# EasyEDA Pro project ProProject_EL_Driver_2024-06-29.epro

# Schematic Schematic1_1

## Sheets
1 MAIN: Create Date: 2024-05-11; Page Name: MAIN; Project Name: EL_Driver; Schematic Name: Schematic1_1; Update Date: 2024-05-11; Company: 嘉立创EDA; Page Size: A4; Version: V1.0
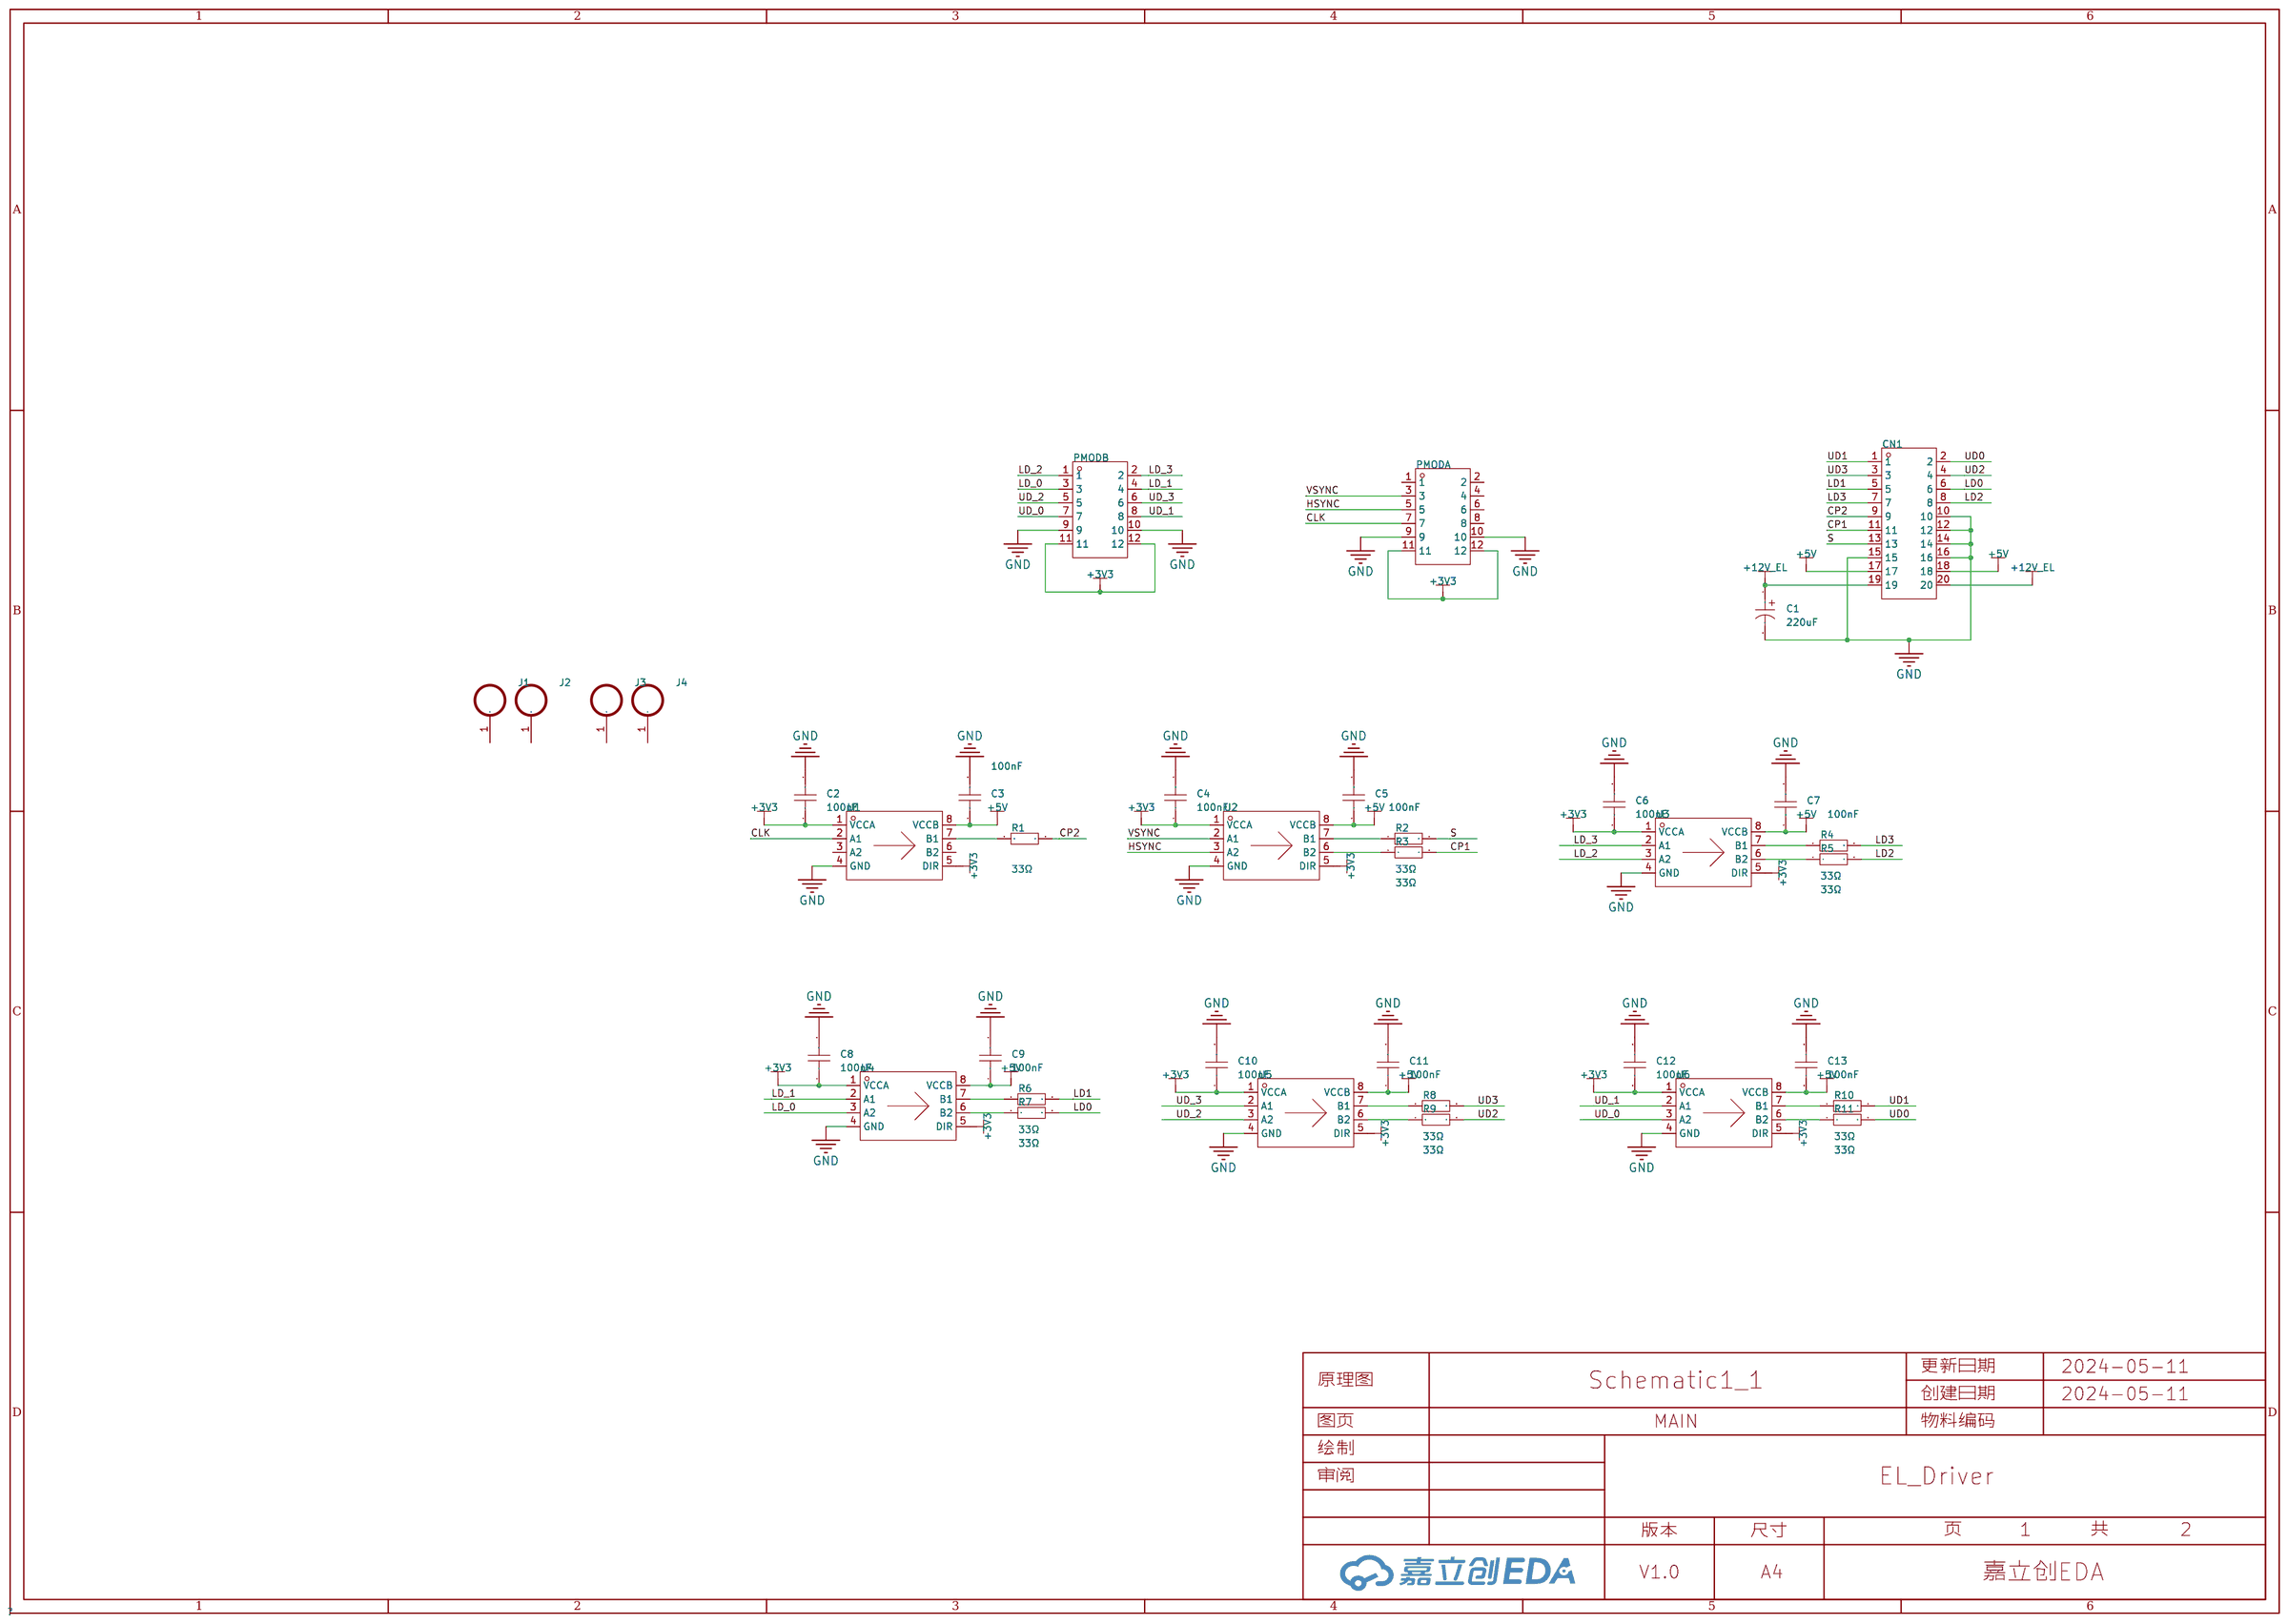
[diagram p0: MAIN]
2 POWER: Page Name: POWER
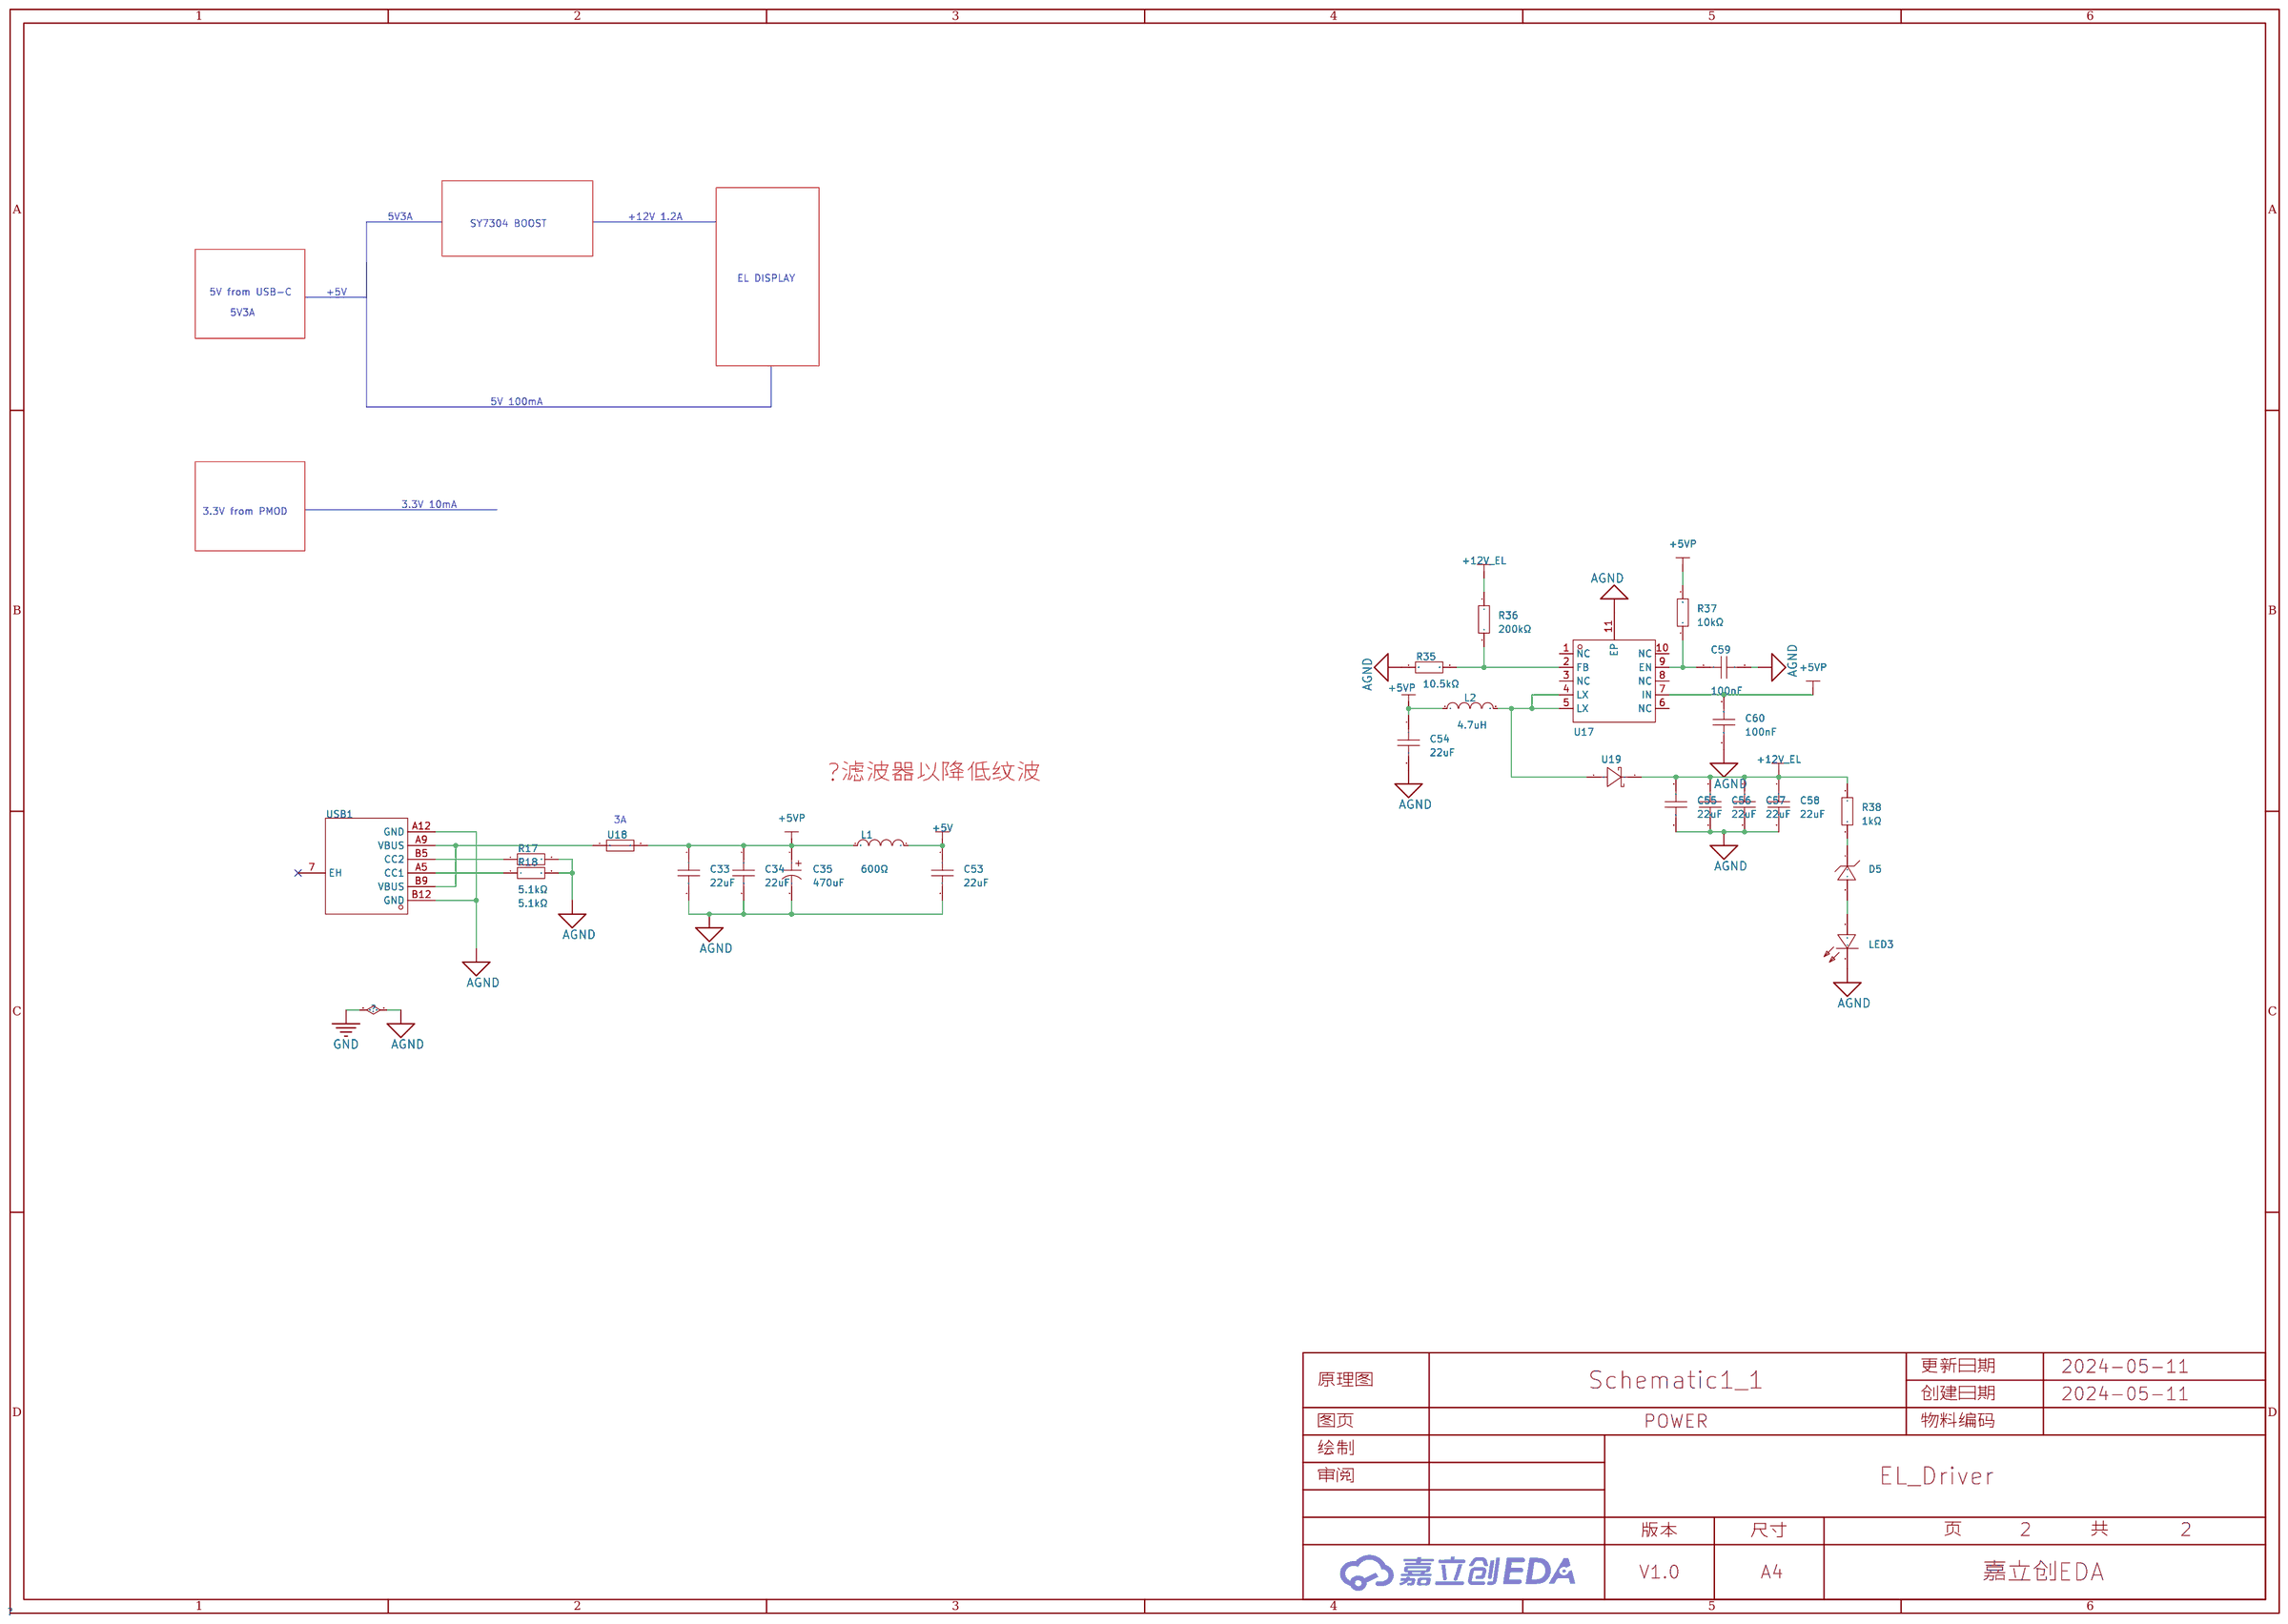
[diagram p1: POWER]

## Parts
sheet MAIN
C1  220uF  [CAP-SMD_BD6.3-L6.6-W6.6-FD]
C2  100nF  [C0603]
C3  100nF  [C0603]
C4  100nF  [C0603]
C5  100nF  [C0603]
C6  100nF  [C0603]
C7  100nF  [C0603]
C8  100nF  [C0603]
C9  100nF  [C0603]
C10  100nF  [C0603]
C11  100nF  [C0603]
C12  100nF  [C0603]
C13  100nF  [C0603]
CN1  HC-PHD-2*10AW  [CONN-TH_20P-P2.00_HCTL_HC-PHD]
J1  -  [螺孔]
J2  -  [螺孔]
J3  -  [螺孔]
J4  -  [螺孔]
PMODA  CS-1107-2X6(L14/19)  [HDR-TH_12P-P2.54-H-M-R2-C6-S2.54-W9.5-N]
PMODB  CS-1107-2X6(L14/19)  [HDR-TH_12P-P2.54-H-M-R2-C6-S2.54-W9.5-N]
R1  33Ω  [R0603]
R2  33Ω  [R0603]
R3  33Ω  [R0603]
R4  33Ω  [R0603]
R5  33Ω  [R0603]
R6  33Ω  [R0603]
R7  33Ω  [R0603]
R8  33Ω  [R0603]
R9  33Ω  [R0603]
R10  33Ω  [R0603]
R11  33Ω  [R0603]
U1  SN74LVC2T45DCUT  [VSSOP-8_L2.3-W2.0-P0.50-LS3.1-BL]
U2  SN74LVC2T45DCUT  [VSSOP-8_L2.3-W2.0-P0.50-LS3.1-BL]
U3  SN74LVC2T45DCUT  [VSSOP-8_L2.3-W2.0-P0.50-LS3.1-BL]
U4  SN74LVC2T45DCUT  [VSSOP-8_L2.3-W2.0-P0.50-LS3.1-BL]
U5  SN74LVC2T45DCUT  [VSSOP-8_L2.3-W2.0-P0.50-LS3.1-BL]
U6  SN74LVC2T45DCUT  [VSSOP-8_L2.3-W2.0-P0.50-LS3.1-BL]
sheet POWER
C33  22uF  [C0805]
C34  22uF  [C0805]
C35  470uF  [CAP-SMD_BD6.3-L6.6-W6.6-LS7.6-RD]
C53  22uF  [C0805]
C54  22uF  [C0805]
C55  22uF  [C0805]
C56  22uF  [C0805]
C57  22uF  [C0805]
C58  22uF  [C0805]
C59  100nF  [C0603]
C60  100nF  [C0603]
D5  LMSZ5239BT1G  [SOD-123_L2.7-W1.6-LS3.7-RD]
L1  600Ω  [L0603]
L2  4.7uH  [IND-SMD_L5.4-W5.2_FXL0530]
LED3  KT-0603R  [LED0603-RD]
R17  5.1kΩ  [R0603]
R18  5.1kΩ  [R0603]
R35  10.5kΩ  [R0603]
R36  200kΩ  [R0603]
R37  10kΩ  [R0603]
R38  1kΩ  [R0603]
U17  SY7304DBC  [DFN-10_L3.0-W3.0-P0.50-BL-EP]
U18  1812L300/12GR  [F1812]
U19  SS54  [SMB_L4.3-W3.6-LS5.4-RD]
USB1  TYPE-C 6P(073)  [TYPE-C-SMD_TYPE-C-6P]

## Library data of the parts
C1 = RVT220UF16V67RV0015: 容值:220uF;精度:±20%;额定电压:16V;纹波电流:110mA@120Hz;等效串联电阻:-;; LCSC Part Name: 220uF ±20% 16V; Supplier Part: C2887273; Manufacturer: KNSCHA(科尼盛); Supplier Footprint: SMD,D6.3xL7.7mm; JLCPCB Part Class: 扩展库; Datasheet: https://atta.szlcsc.com/upload/public/pdf/source/20210824/3DC9999D9B098FE241E3A26137981C4C.pdf; Supplier: LCSC; Tolerance: ±20%; Rated Voltage: 16V; Ripple Current: 110mA@120Hz; φD: 6.3mm; L: 7.7mm; Lifetime @ Temp: 2000hrs@105℃; Operating Temperature: -55℃~+105℃
C2-C13 C59 C60 = CC0603KRX7R9BB104: 容值:100nF;精度:±10%;额定电压:50V;材质(温度系数):X7R;; LCSC Part Name: 100nF ±10% 50V; Supplier Part: C14663; Manufacturer: YAGEO(国巨); Supplier Footprint: 0603; JLCPCB Part Class: 基础库; Datasheet: https://atta.szlcsc.com/upload/public/pdf/source/20180910/C282072_33301C7F631E79921B82A8DAC6BCC5B3.pdf; Supplier: LCSC; Tolerance: ±10%; Voltage Rated: 50V; Temperature Coefficient: X7R
CN1 = HC-PHD-2*10AW: 插针结构:2x10P;间距:2mm;安装方式:弯插;参考系列:PHD;总PIN数:20P;排数:2;每排PIN数:10;行距:2mm;额定电流:3A;触头材质:黄铜;触头镀层:锡;工作温度范围:-25℃~+85℃;; LCSC Part Name: 2x10P 间距:2mm 弯插 系列:PHD; Supplier Part: C2845639; Manufacturer: HCTL(华灿天禄); Supplier Footprint: 弯插,P=2mm; JLCPCB Part Class: 扩展库; Supplier: LCSC; Pins Structure: 2x10P; Pitch: 2mm; Mounting Style: 弯插; Reference Series: PHD; Number of Pins: 20P; Number of Rows: 2; Number of PINs Per Row: 10; Row Spacing: 2mm; Current Rating (Max): 3A; Contact Material: 黄铜; Contact Plating: 锡; Operating Temperature Range: -25℃~+85℃
J1-J4 = 螺孔
PMODA PMODB = CS-1107-2X6(L14/19): 插针结构:2x6P;间距:2.54mm;行距:2.54mm;圆针/方针:方针;安装类型:弯插;排数:双排;总PIN位数:12P;额定电流:3A;额定电压:250V;配合针长度:6mm;塑高:2.54mm;端接针长度:-;工作温度范围:-40℃~+105℃;颜色:黑色;; LCSC Part Name: 间距:2.54mm 2x6P 弯插 方针; Supplier Part: C2911299; Manufacturer: CST(永丰盈); Supplier Footprint: 弯插,P=2.54mm; JLCPCB Part Class: 扩展库; Datasheet: https://atta.szlcsc.com/upload/public/pdf/source/20211110/474D709B92808FAB655074F4DF73F5F5.pdf; Supplier: LCSC; Pin Structure: 2x6P; Pitch: 2.54mm; Row Spacing: 2.54mm; Circluar Pins/Square Pins: 方针; Mounting Type: 弯插; Number of Rows: 双排; Number of Pins: 12P; Current Rating (Max): 3A; Voltage Rating (Max): 250V; Length of Mating Pin: 6mm; Insulation Height: 2.54mm; Operating Temperature Range: -40℃~+105℃; Color: 黑色
R1-R11 = 0603WAF330JT5E: 电阻类型:厚膜电阻;阻值:33Ω;精度:±1%;功率:100mW;最大工作电压:75V;温度系数:±100ppm/℃;; LCSC Part Name: 33Ω ±1% 100mW 厚膜电阻; Supplier Part: C23140; Manufacturer: UNI-ROYAL(厚声); Supplier Footprint: 0603; JLCPCB Part Class: 基础库; Datasheet: https://atta.szlcsc.com/upload/public/pdf/source/20200306/C422600_1E6D84923E4A46A82E41ADD87F860B5C.pdf; Supplier: LCSC; Type: 厚膜电阻; Tolerance: ±1%; Power(Watts): 100mW; Overload Voltage (Max): 75V; Temperature Coefficient: ±100ppm/℃; Operating Temperature Range: -55℃~+155℃
U1-U6 = SN74LVC2T45DCUT: 数据速率:420Mbps;电压(VCCA):1.65V~5.5V;电压(VCCB):1.65V~5.5V;电路数:1;每个电路通道数:2;; LCSC Part Name: 420Mbps 2位双向电平转换器; Supplier Part: C2652942; Manufacturer: TI(德州仪器); Supplier Footprint: VSSOP-8-0.5mm; JLCPCB Part Class: 扩展库; Datasheet: https://www.ti.com/cn/lit/gpn/sn74lvc2t45; Supplier: LCSC; Channel Type: 双向; Data Rate: 420Mbps; Supply Voltage (VCCA): 1.65V~5.5V; Supply Voltage (VCCB): 1.65V~5.5V; Number of Circuits: 1; Channels per Circuit: 2; Output Type: 三态；非反相; Operating Temperature: -40℃~+85℃
C33 C34 C53-C58 = CL21A226MAQNNNE: 容值:22uF;精度:±20%;额定电压:25V;材质(温度系数):X5R;; LCSC Part Name: 22uF ±20% 25V; Supplier Part: C45783; Manufacturer: SAMSUNG(三星); Supplier Footprint: 0805; JLCPCB Part Class: 基础库; Datasheet: https://atta.szlcsc.com/upload/public/pdf/source/20160218/1457707763339.pdf; Supplier: LCSC; Tolerance: ±20%; Voltage Rated: 25V; Temperature Coefficient: X5R
C35 = RVT1C471M0607: 容值:470uF;精度:±20%;额定电压:16V;纹波电流:185mA@120Hz;; LCSC Part Name: 470uF ±20% 16V; Supplier Part: C2977552; Manufacturer: ROQANG(容强); Supplier Footprint: SMD,D6.3xL7.7mm; JLCPCB Part Class: 扩展库; Datasheet: https://atta.szlcsc.com/upload/public/pdf/source/20220223/DD822675CC1DF2F0C06D5C2255C9C2D9.pdf; Supplier: LCSC; Tolerance: ±20%; Rated Voltage: 16V; Ripple Current: 185mA@120Hz; φD: 6.3mm; L: 7.7mm; Lifetime @ Temp: 2000hrs@105℃; Operating Temperature: -40℃~+105℃
D5 = LMSZ5239BT1G: 二极管配置:独立式;稳压值(标称值):9.1V;稳压值(范围):8.65V~9.56V;功率:500mW;精度:±5%;; Supplier Part: C131746; Manufacturer: LRC(乐山无线电); Supplier Footprint: SOD-123; JLCPCB Part Class: 扩展库; Datasheet: https://atta.szlcsc.com/upload/public/pdf/source/20190903/C417306_219B7495E7FABA1DEE9499B949639C76.pdf; Supplier: LCSC; Diode Configuration: 独立式; Zener Voltage (Nom): 9.1V; Reverse Leakage Current (Ir): 20mA; Zener Voltage (Range): 8.65V~9.56V; Power Dissipation: 500mW; Zener Impedance (Zzt): 10Ω; Tolerance: ±5%
L1 = GZ1608D601TF: 标称阻抗@测试频率:600Ω@100MHz;误差:±25%;直流电阻(RDC):450mΩ;; LCSC Part Name: 单路 0603磁珠 阻抗600Ω@100MHz; Supplier Part: C1002; Manufacturer: Sunlord(顺络); Supplier Footprint: 0603; JLCPCB Part Class: 基础库; Datasheet: https://atta.szlcsc.com/upload/public/pdf/source/20231030/9B6A3E87682CEC1FF6638DFAA81D73FA.pdf; Supplier: LCSC; Impedance @ Frequency: 600Ω@100MHz; Tolerance: ±25%; DC Resistance: 450mΩ; Current Rating: 200mA; Circuits: 1
L2 = FXL0530-4R7-M: 电感值:4.7uH;精度:±20%;额定电流:4.5A;饱和电流(Isat):5A;类型:一体成型电感;; LCSC Part Name: 4.7uH ±20% 5A; Supplier Part: C177246; Manufacturer: cjiang(长江微电); Supplier Footprint: SMD,5.2x5.4mm; JLCPCB Part Class: 扩展库; Datasheet: https://atta.szlcsc.com/upload/public/pdf/source/20230516/4BF6F9C76E81720F52A39ED5FFFA18B4.pdf; Supplier: LCSC; Tolerance: ±20%; Rated Current: 4.5A; Saturation Current (Isat): 5A; DC Resistance (DCR): 60mΩ; Type: 一体成型电感
LED3 = KT-0603R: 发光颜色:红色;功率:-;正向电流:-;主波长:-;二极管配置:-;透镜颜色:-;色温:-;发光角度:-;载带方式:-;工作温度:-40℃~+85℃;; LCSC Part Name: 0603 红灯 高亮; Supplier Part: C2286; Manufacturer: KENTO; Supplier Footprint: 0603; JLCPCB Part Class: 基础库; Datasheet: https://atta.szlcsc.com/upload/public/pdf/source/20160616/1466072038404.pdf; Supplier: LCSC; Emitted Color: 红色; Operating Temperature: -40℃~+85℃
R17 R18 = 0603WAF5101T5E: 电阻类型:厚膜电阻;阻值:5.1kΩ;精度:±1%;功率:100mW;最大工作电压:75V;温度系数:±100ppm/℃;; LCSC Part Name: 5.1kΩ ±1% 100mW 厚膜电阻; Supplier Part: C23186; Manufacturer: UNI-ROYAL(厚声); Supplier Footprint: 0603; JLCPCB Part Class: 基础库; Datasheet: https://atta.szlcsc.com/upload/public/pdf/source/20200306/C422600_1E6D84923E4A46A82E41ADD87F860B5C.pdf; Supplier: LCSC; Type: 厚膜电阻; Tolerance: ±1%; Power(Watts): 100mW; Overload Voltage (Max): 75V; Temperature Coefficient: ±100ppm/℃; Operating Temperature Range: -55℃~+155℃
R35 = 0603WAF1052T5E: 电阻类型:厚膜电阻;阻值:10.5kΩ;精度:±1%;功率:100mW;最大工作电压:75V;温度系数:±100ppm/℃;; LCSC Part Name: 10.5kΩ ±1% 100mW 厚膜电阻; Supplier Part: C22855; Manufacturer: UNI-ROYAL(厚声); Supplier Footprint: 0603; JLCPCB Part Class: 扩展库; Datasheet: https://atta.szlcsc.com/upload/public/pdf/source/20200306/C422600_1E6D84923E4A46A82E41ADD87F860B5C.pdf; Supplier: LCSC; Type: 厚膜电阻; Tolerance: ±1%; Power(Watts): 100mW; Overload Voltage (Max): 75V; Temperature Coefficient: ±100ppm/℃; Operating Temperature Range: -55℃~+155℃
R36 = 0603WAF2003T5E: 电阻类型:厚膜电阻;阻值:200kΩ;精度:±1%;功率:100mW;最大工作电压:75V;温度系数:±100ppm/℃;; LCSC Part Name: 200kΩ ±1% 100mW 厚膜电阻; Supplier Part: C25811; Manufacturer: UNI-ROYAL(厚声); Supplier Footprint: 0603; JLCPCB Part Class: 基础库; Datasheet: https://atta.szlcsc.com/upload/public/pdf/source/20200306/C422600_1E6D84923E4A46A82E41ADD87F860B5C.pdf; Supplier: LCSC; Type: 厚膜电阻; Tolerance: ±1%; Power(Watts): 100mW; Overload Voltage (Max): 75V; Temperature Coefficient: ±100ppm/℃; Operating Temperature Range: -55℃~+155℃
R37 = 0603WAF1002T5E: 电阻类型:厚膜电阻;阻值:10kΩ;精度:±1%;功率:100mW;最大工作电压:75V;温度系数:±100ppm/℃;; LCSC Part Name: 厚膜电阻 10kΩ ±1% 100mW; Supplier Part: C25804; Manufacturer: UNI-ROYAL(厚声); Supplier Footprint: 0603; JLCPCB Part Class: 基础库; Datasheet: https://atta.szlcsc.com/upload/public/pdf/source/20200306/C422600_1E6D84923E4A46A82E41ADD87F860B5C.pdf; Supplier: LCSC; Type: 厚膜电阻; Tolerance: ±1%; Power(Watts): 100mW; Overload Voltage (Max): 75V; Temperature Coefficient: ±100ppm/℃; Operating Temperature Range: -55℃~+155℃
R38 = 0603WAF1001T5E: 电阻类型:厚膜电阻;阻值:1kΩ;精度:±1%;功率:100mW;最大工作电压:75V;温度系数:±100ppm/℃;; LCSC Part Name: 1kΩ ±1% 100mW 厚膜电阻; Supplier Part: C21190; Manufacturer: UNI-ROYAL(厚声); Supplier Footprint: 0603; JLCPCB Part Class: 基础库; Datasheet: https://atta.szlcsc.com/upload/public/pdf/source/20200306/C422600_1E6D84923E4A46A82E41ADD87F860B5C.pdf; Supplier: LCSC; Type: 厚膜电阻; Tolerance: ±1%; Power(Watts): 100mW; Overload Voltage (Max): 75V; Temperature Coefficient: ±100ppm/℃; Operating Temperature Range: -55℃~+155℃
U17 = SY7304DBC: 功能类型:升压型;输入电压:3V~33V;输出电压:600mV~33V;输出电流(最大值):4A;; Supplier Part: C178252; Manufacturer: silergy(矽力杰); Supplier Footprint: DFN-10-EP(3x3); JLCPCB Part Class: 扩展库; Datasheet: https://atta.szlcsc.com/upload/public/pdf/source/20180731/C178252_5F7F966386B28EA7E34420693AF59FF5.pdf; Supplier: LCSC; Function: 升压型; Input Voltage: 3V~33V; Output Voltage: 600mV~33V; Output Current (Max): 4A; Switching Frequency: 1MHz; Synchronous Rectification: 否; Number of Outputs: 1; Topology: 升压式; Switch tube (built-in/external): 内置
U18 = 1812L300/12GR: 最大电压:12V;最大电流:100A;保持电流:3A;跳闸电流:5A;; LCSC Part Name: 12V 3A 自恢复保险丝; Supplier Part: C18198348; Manufacturer: LUTE(陆特); Supplier Footprint: 1812; JLCPCB Part Class: 扩展库; Datasheet: https://atta.szlcsc.com/upload/public/pdf/source/20230926/57461D6230B1C3E982BE957E074F147E.pdf; Supplier: LCSC; Operating Voltage (Max): 12V; Current Rating (Max): 100A; Hold Current: 3A; Trip Current: 5A; Power Dissipation: 1.2W; Resistance - Initial (Ri) (Min): 10mΩ; Resistance - Post Trip (R1) (Max): 50mΩ; Maximum Time to Trip: 4s; Operating Temperature: -40℃~+85℃
U19 = SS54_1: 二极管配置:独立式;正向压降(Vf):550mV@5A;直流反向耐压(Vr):40V;平均整流电流(Io):5A;; LCSC Part Name: 电压:40V 电流:5A; Supplier Part: C5200096; Manufacturer: HXY MOSFET(华轩阳电子); Supplier Footprint: SMB; JLCPCB Part Class: 扩展库; Datasheet: https://atta.szlcsc.com/upload/public/pdf/source/20230913/C27D87353D79BBE602B94108547A3D53.pdf; Supplier: LCSC; Diode Configuration: 独立式; Forward Voltage (Vf@If): 550mV@5A; Reverse Voltage (Vr): 40V; Average Rectified Current (Io): 5A; Reverse Leakage Current (Ir): 500uA@40V
USB1 = TYPE-C 6P(073): 连接器类型:Type-C;标准:-;公母:母;端口数量:1;触点数量:6P;安装方式:卧贴;额定电流 - 电源:5A;工作温度范围:-25℃~+85℃;; LCSC Part Name: Type-C 母 卧贴; Supplier Part: C668623; Manufacturer: SHOU HAN(首韩); Supplier Footprint: SMD; JLCPCB Part Class: 扩展库; Datasheet: https://atta.szlcsc.com/upload/public/pdf/source/20200618/C668623_A4B260DED7AC1949BAC6AE39E9F4CD80.pdf; Supplier: LCSC; Connector Type: Type-C; Gender: 母; Number of Ports: 1; Number of Contacts: 6P; Mounting Style: 卧贴; Current Rating - Power (Max): 5A; Operating Temperature Range: -25℃~+85℃

## Nets
+3V3: C2.1 C4.1 C6.1 C8.1 C10.1 C12.1 PMODA.11 PMODA.12 PMODB.11 PMODB.12 U1.1(VCCA) U1.5(DIR) U2.1(VCCA) U2.5(DIR) U3.1(VCCA) U3.5(DIR) U4.1(VCCA) U4.5(DIR) U5.1(VCCA) U5.5(DIR) U6.1(VCCA) U6.5(DIR)
+5V: C3.1 C5.1 C7.1 C9.1 C11.1 C13.1 C53.1 CN1.17 CN1.18 L1.2 U1.8(VCCB) U2.8(VCCB) U3.8(VCCB) U4.8(VCCB) U5.8(VCCB) U6.8(VCCB)
+5VP: C33.1 C34.1 C35.1 C54.1 C60.2 L1.1 L2.1 R37.2 U17.7(IN) U18.2
+12V_EL: C1.1 C55.1 C56.1 C57.1 C58.1 CN1.19 CN1.20 R36.1 R38.2 U19.1
AGND: C1.2 C2.2 C3.2 C4.2 C5.2 C6.2 C7.2 C8.2 C9.2 C10.2 C11.2 C12.2 C13.2 C33.2 C34.2 C35.2 C53.2 C54.2 C55.2 C56.2 C57.2 C58.2 C59.2 C60.1 CN1.10 CN1.12 CN1.14 CN1.15 CN1.16 LED3.1(K) PMODA.9 PMODA.10 PMODB.9 PMODB.10 R17.2 R18.2 R35.1 U1.4(GND) U2.4(GND) U3.4(GND) U4.4(GND) U5.4(GND) U6.4(GND) U17.11(EP) USB1.A12(GND) USB1.B12(GND)
CLK: PMODA.7 U1.2(A1)
CP1: CN1.11 R3.2
CP2: CN1.9 R1.2
HSYNC: PMODA.5 U2.3(A2)
LD0: CN1.6 R7.2
LD1: CN1.5 R6.2
LD2: CN1.8 R5.2
LD3: CN1.7 R4.2
LD_0: PMODB.3 U4.3(A2)
LD_1: PMODB.4 U4.2(A1)
LD_2: PMODB.1 U3.3(A2)
LD_3: PMODB.2 U3.2(A1)
S: CN1.13 R2.2
UD0: CN1.2 R11.2
UD1: CN1.1 R10.2
UD2: CN1.4 R9.2
UD3: CN1.3 R8.2
UD_0: PMODB.7 U6.3(A2)
UD_1: PMODB.8 U6.2(A1)
UD_2: PMODB.5 U5.3(A2)
UD_3: PMODB.6 U5.2(A1)
VSYNC: PMODA.3 U2.2(A1)
$1N1810: R2.1 U2.7(B1)
$1N1813: R3.1 U2.6(B2)
$1N2397: R1.1 U1.7(B1)
$1N3960: R4.1 U3.7(B1)
$1N3962: R5.1 U3.6(B2)
$1N10501: R6.1 U4.7(B1)
$1N10502: R7.1 U4.6(B2)
$1N10708: R8.1 U5.7(B1)
$1N10709: R9.1 U5.6(B2)
$1N10915: R10.1 U6.7(B1)
$1N10916: R11.1 U6.6(B2)
$2N5370: R17.1 USB1.B5(CC2)
$2N5376: R18.1 USB1.A5(CC1)
$2N5502: U18.1 USB1.A9(VBUS) USB1.B9(VBUS)
$2N10283: L2.2 U17.4(LX) U17.5(LX) U19.2
$2N10772: R35.2 R36.2 U17.2(FB)
$2N10889: C59.1 R37.1 U17.9(EN)
$2N11071: D5.1(C) R38.1
$2N11072: D5.2(A) LED3.2(A)

Not connected (* = marked no-connect by the designer): J1 1; J2 1; J3 1; J4 1; PMODA 1 2 4 6 8; U1 3(A2) 6(B2); U17 1(NC) 3(NC) 6(NC) 8(NC) 10(NC); USB1 7(EH)*

## Notes on the sheets
sheet 2
- 5V3A
- +12V 1.2A
- SY7304 BOOST
- EL DISPLAY
- 5V from USB-C
- +5V
- 5V3A
- 5V 100mA
- 3.3V from PMOD
- 3.3V 10mA
- 🥧滤波器以降低纹波
- 3A

# Board PCB1_1
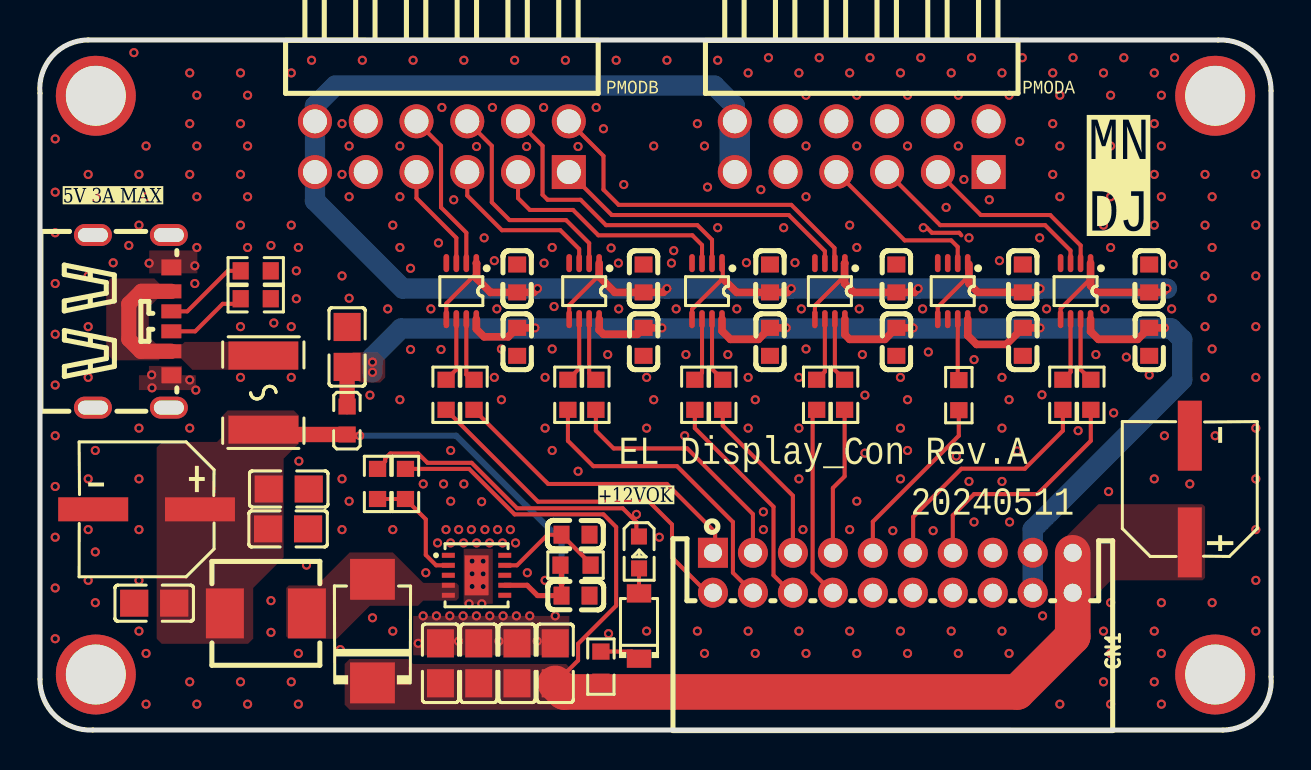
[diagram p2: board, top side]
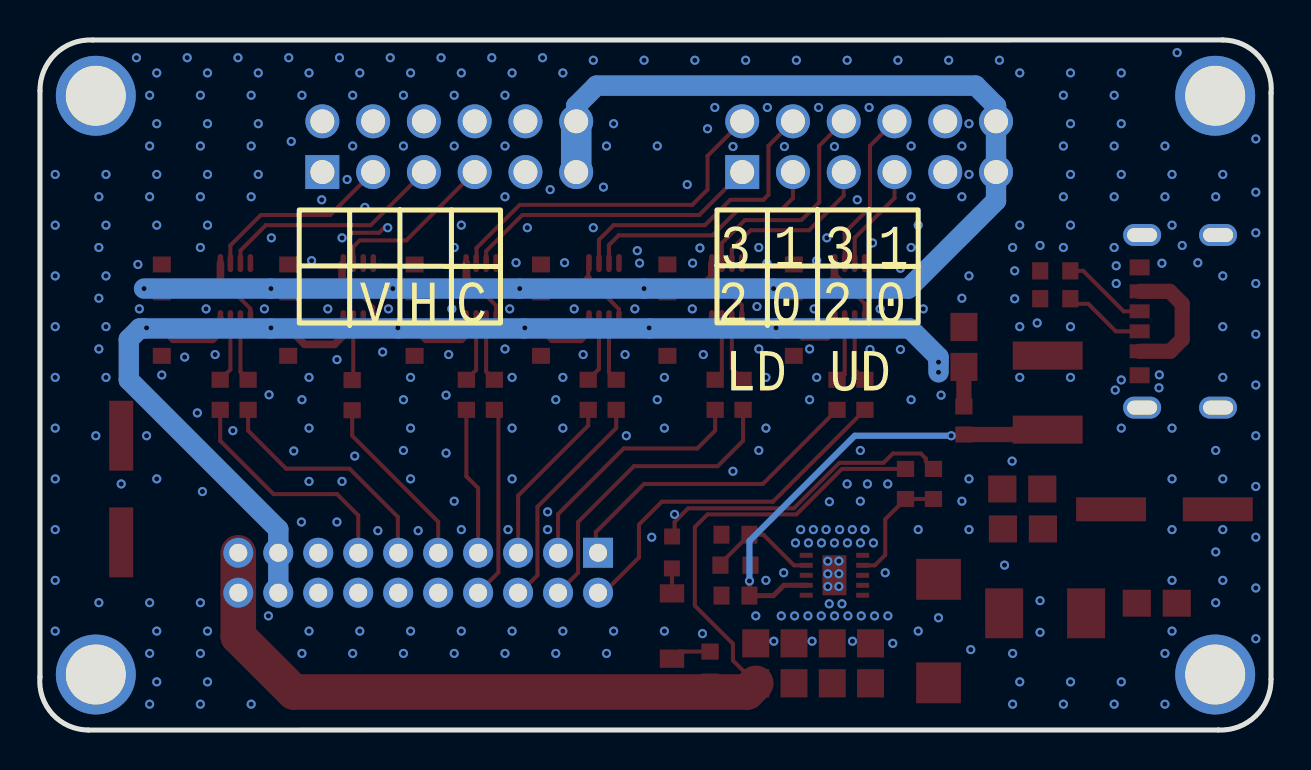
[diagram p3: board, bottom side, seen from below]

Outline 61.59 x 34.54 mm; copper layers: Top Layer, Bottom Layer. Coordinates in mm from the lower left corner of the outline.
Outline path: 0,31.88 arc(0.62,33.74) 2.41,34.54 58.95,34.54 arc(60.82,33.84) 61.59,32 61.59,2.67 arc(60.98,0.8) 59.18,0 2.64,0 arc(0.77,0.7) 0,2.54 0,31.88
Stack: Top Layer 0.035mm / Dielectric1 1.51mm FR4 er 4.5 / Bottom Layer 0.035mm

## Design rules (mm)
net AGND: PWR
net +5V: PWR
net +3V3: PWR
net +12V_EL: PWR
net +5VP: PWR
template: 自定义配置
spacing copperThickness1oz (default): track to track 0.102, other pairs 0.102 to 0.3
spacing copperThickness2oz: track to track 0.203, other pairs 0.152 to 0.3
track width copperThickness1oz (default): min 0.127, default 0.203, max 2.54
track width PWR: min 0.203, default 0.381, max 2.54
differential pair differentialPair (default): width min 0.127, default 0.254, max 2.54; gap min 0.152, default 0.152
via viaSize (default): diameter min 0.457, default 0.457, max 10; hole min 0.254, default 0.254, max 6.299
net class PWR uses PWR
net AGND uses PWR
net +5V uses PWR
net +3V3 uses PWR
net +12V_EL uses PWR
net +5VP uses PWR

## Placement (name value [footprint] x y rotation side)
C1  220uF  [CAP-SMD_BD6.3-L6.6-W6.6-FD]  57.53 12.06 90 top
C2  100nF  [C0603]  49.17 22.61 90 top
C3  100nF  [C0603]  49.17 19.43 270 top
C4  100nF  [C0603]  55.5 22.61 90 top
C5  100nF  [C0603]  55.5 19.43 270 top
C6  100nF  [C0603]  42.85 22.61 90 top
C7  100nF  [C0603]  42.85 19.43 270 top
C8  100nF  [C0603]  36.53 22.61 90 top
C9  100nF  [C0603]  36.53 19.43 270 top
C10  100nF  [C0603]  30.2 22.61 90 top
C11  100nF  [C0603]  30.2 19.43 270 top
C12  100nF  [C0603]  23.88 22.61 90 top
C13  100nF  [C0603]  23.88 19.43 270 top
C33  22uF  [C0805]  12.41 10.07 0 top
C34  22uF  [C0805]  12.45 12.07 0 top
C35  470uF  [CAP-SMD_BD6.3-L6.6-W6.6-LS7.6-RD]  5.33 11.05 180 top
C53  22uF  [C0805]  15.37 19.18 90 top
C54  22uF  [C0805]  5.72 6.35 180 top
C55  22uF  [C0805]  25.78 3.34 90 top
C56  22uF  [C0805]  20.04 3.34 90 top
C57  22uF  [C0805]  21.95 3.34 90 top
C58  22uF  [C0805]  23.87 3.34 90 top
C59  100nF  [C0603]  26.8 9.78 0 top
C60  100nF  [C0603]  26.8 6.73 180 top
CN1  HC-PHD-2*10AW  [CONN-TH_20P-P2.00_HCTL_HC-PHD]  42.67 7.87 0 top
D5  LMSZ5239BT1G  [SOD-123_L2.7-W1.6-LS3.7-RD]  29.97 5.21 90 top
J1  -  [螺孔]  2.79 31.75 0 top
J2  -  [螺孔]  58.8 31.75 0 top
J3  -  [螺孔]  2.79 2.78 0 top
J4  -  [螺孔]  58.8 2.78 0 top
L1  600Ω  [L0603]  15.37 15.49 90 top
L2  4.7uH  [IND-SMD_L5.4-W5.2_FXL0530]  11.3 5.84 0 top
LED3  KT-0603R  [LED0603-RD]  29.97 8.89 270 top
PMODA  CS-1107-2X6(L14/19)  [HDR-TH_12P-P2.54-H-M-R2-C6-S2.54-W9.5-N]  41.12 29.2 180 top
PMODB  CS-1107-2X6(L14/19)  [HDR-TH_12P-P2.54-H-M-R2-C6-S2.54-W9.5-N]  20.11 29.2 180 top
R1  33Ω  [R0603]  45.97 16.76 270 top
R2  33Ω  [R0603]  52.58 16.78 270 top
R3  33Ω  [R0603]  51.18 16.78 270 top
R4  33Ω  [R0603]  40.26 16.78 270 top
R5  33Ω  [R0603]  38.86 16.78 270 top
R6  33Ω  [R0603]  34.16 16.78 270 top
R7  33Ω  [R0603]  32.77 16.78 270 top
R8  33Ω  [R0603]  27.81 16.78 270 top
R9  33Ω  [R0603]  26.42 16.78 270 top
R10  33Ω  [R0603]  21.72 16.78 270 top
R11  33Ω  [R0603]  20.32 16.78 270 top
R17  5.1kΩ  [R0603]  10.79 21.59 0 top
R18  5.1kΩ  [R0603]  10.79 22.99 0 top
R35  10.5kΩ  [R0603]  16.89 12.32 270 top
R36  200kΩ  [R0603]  18.29 12.32 270 top
R37  10kΩ  [R0603]  26.8 8.25 180 top
R38  1kΩ  [R0603]  28.07 3.17 270 top
U1  SN74LVC2T45DCUT  [VSSOP-8_L2.3-W2.0-P0.50-LS3.1-BL]  45.67 21.97 180 top
U2  SN74LVC2T45DCUT  [VSSOP-8_L2.3-W2.0-P0.50-LS3.1-BL]  51.82 21.97 180 top
U3  SN74LVC2T45DCUT  [VSSOP-8_L2.3-W2.0-P0.50-LS3.1-BL]  39.52 21.97 180 top
U4  SN74LVC2T45DCUT  [VSSOP-8_L2.3-W2.0-P0.50-LS3.1-BL]  33.38 21.97 180 top
U5  SN74LVC2T45DCUT  [VSSOP-8_L2.3-W2.0-P0.50-LS3.1-BL]  27.23 21.97 180 top
U6  SN74LVC2T45DCUT  [VSSOP-8_L2.3-W2.0-P0.50-LS3.1-BL]  21.08 21.97 180 top
U17  SY7304DBC  [DFN-10_L3.0-W3.0-P0.50-BL-EP]  21.84 7.75 270 top
U18  1812L300/12GR  [F1812]  11.18 16.89 270 top
U19  SS54  [SMB_L4.3-W3.6-LS5.4-RD]  16.64 4.95 90 top
USB1  TYPE-C 6P(073)  [TYPE-C-SMD_TYPE-C-6P]  4.61 20.46 270 top

## Footprints (pads in the part's own frame, mm; a bottom-side part is the same pattern mirrored in y, then rotated)
C0603
  rect 0.8x0.9 smd: 1(-0.7,0) 2(0.7,0)
C0805
  rect 1.41x1.35 smd: 1(-1,0) 2(1,0)
CAP-SMD_BD6.3-L6.6-W6.6-FD
  rect 3.5x1.2 smd: 1(-2.67,0) 2(2.67,0)
CAP-SMD_BD6.3-L6.6-W6.6-LS7.6-RD
  rect 3.5x1.2 smd: 1(-2.67,0) 2(2.67,0)
CONN-TH_20P-P2.00_HCTL_HC-PHD
  rect 1.5x1.5 hole 0.9: 1(-9,1)
  round 1.5 hole 0.9: 2(-9,-1) 3(-7,1) 4(-7,-1) 5(-5,1) 6(-5,-1) 7(-3,1) 8(-3,-1) 9(-1,1) 10(-1,-1) 11(1,1) 12(1,-1) 13(3,1) 14(3,-1) 15(5,1) 16(5,-1) 17(7,1) 18(7,-1) 19(9,1) 20(9,-1)
DFN-10_L3.0-W3.0-P0.50-BL-EP
  rect 0.25x0.65 smd: 1(-1,-1.411) 2(-0.5,-1.411) 3(0,-1.411) 4(0.5,-1.411) 5(1,-1.411) 6(1,1.411) 7(0.5,1.411) 8(0,1.411) 9(-0.5,1.411) 10(-1,1.411)
  rect 2x1.2 smd: 11(0,0)
F1812
  rect 1.407x3.499 smd: 1(-1.853,0) 2(1.853,0)
HDR-TH_12P-P2.54-H-M-R2-C6-S2.54-W9.5-N
  rect 1.7x1.7 hole 1.2: 1(-6.35,1.27)
  round 1.7 hole 1.2: 2(-6.35,-1.27) 3(-3.81,1.27) 4(-3.81,-1.27) 5(-1.27,1.27) 6(-1.27,-1.27) 7(1.27,1.27) 8(1.27,-1.27) 9(3.81,1.27) 10(3.81,-1.27) 11(6.35,1.27) 12(6.35,-1.27)
IND-SMD_L5.4-W5.2_FXL0530
  rect 1.9x2.5 smd: 1(-2.05,0) 2(2.05,0)
L0603
  rect 0.8x0.864 smd: 1(-0.7,0) 2(0.7,0)
LED0603-RD
  rect 0.8x0.8 smd: 1(-0.799,-0.004) 2(0.799,0.004)
R0603
  rect 0.806x0.864 smd: 1(-0.753,0) 2(0.753,0)
SMB_L4.3-W3.6-LS5.4-RD
  rect 2.047x2.241 smd: 1(-2.591,0) 2(2.591,0)
SOD-123_L2.7-W1.6-LS3.7-RD
  rect 0.91x1.22 smd: 1(-1.635,0) 2(1.635,0)
TYPE-C-SMD_TYPE-C-6P
  oval 1.1x1.9 hole 0.7x1.5: 7(-4.32,1.837) 7(-4.32,-1.962) 7(4.32,1.837) 7(4.32,-1.962)
  rect 0.7x1 smd: A5(-0.5,1.962) A9(1.5,1.962) B5(0.5,1.962) B9(-1.5,1.962)
  rect 0.8x1 smd: A12(2.7,1.962) B12(-2.7,1.962)
VSSOP-8_L2.3-W2.0-P0.50-LS3.1-BL
  oval 0.28x0.905 smd: 1(-0.75,-1.403) 2(-0.25,-1.403) 3(0.25,-1.403) 4(0.75,-1.403) 5(0.75,1.403) 6(0.25,1.403) 7(-0.25,1.403) 8(-0.75,1.403)
螺孔
  round 4 hole 3: 1(0,0)

## Nets
As in the schematic.

Pads without a net: J1 1; J2 1; J3 1; J4 1; PMODA 1 2 4 6 8; U1 3 6; U17 1 3 6 8 10; USB1 7

## Via types
v1: diameter 0.457, hole 0.254, Top Layer to Bottom Layer, 380 vias

## Routing (per net, layer and track width the routed paths; a pad name or vN(x,y) marks a point on that pad's centre or on a via; arc(x,y) is an arc through that point)
+3V3: length 120.3
  Top Layer w0.203: 27.98,22.77 26.48,21.27 26.48,20.57 ; U1.5 44.92,21.17 46.42,22.67 U1.1 ; U2.5 51.07,21.09 52.57,22.59 ; U6.1 21.83,22.85 20.33,21.35 U6.5 ; 40.27,22.75 38.77,21.25 U3.5 ; U4.5 32.63,21.07 34.16,22.61 34.16,23.34 U4.1
  Top Layer w0.381: U3.1 40.26,23.36 40.26,22.35 40.71,21.91 C6.1 43.75,21.91 v1(43.94,22.1) ; v1(24.89,22.1) 24.7,21.91 C12.1 22.54,21.91 21.84,22.61 21.84,23.36 U6.1 ; v1(31.37,22.1) 31.18,21.91 C10.1 28.77,21.91 27.98,22.69 U5.1 ; v1(37.59,22.1) 37.4,21.91 C8.1 34.86,21.91 34.16,22.61 ; 46.48,23.31 46.48,22.35 46.93,21.91 C2.1 49.85,21.91 v1(50.04,22.1) ; v1(56.39,22.1) 56.2,21.91 C4.1 52.9,21.91 52.57,22.24 U2.1
  Bottom Layer w1.016: v1(56.39,22.1) v1(50.04,22.1) v1(43.94,22.1) v1(37.59,22.1) v1(31.37,22.1) v1(24.89,22.1) 18.16,22.1 13.76,26.49 PMODB.11 13.76,31.24 14.78,32.26 33.75,32.26 34.77,31.24 34.77,30.47
  Bottom Layer w1.524: PMODA.11 34.77,30.47
+5V: length 86.3
  Top Layer w0.381: U1.8 46.42,19.75 46.86,19.3 48.35,19.3 C3.1 v1(50.04,20.13) ; U4.8 34.13,19.98 34.54,19.56 35.95,19.56 C9.1 v1(37.34,20.13) ; U3.8 40.27,19.8 40.51,19.56 42.28,19.56 C7.1 v1(43.69,20.13) ; U6.8 21.83,20.08 22.22,19.69 23.43,19.69 C13.1 v1(24.76,20.13) ; v1(31.12,20.13) C11.1 29.88,19.81 28.19,19.81 27.98,20.03 U5.8 ; v1(56.26,20.13) C5.1 54.93,19.56 52.96,19.56 52.57,19.95 U2.8
  Top Layer w0.762: L1.2 C53.1
  Bottom Layer w0.381: v1(31.12,20.13) 31.12,20.12 31.1,20.1 ; v1(24.76,20.13) 24.74,20.1 ; v1(37.34,20.13) 37.34,20.13 37.37,20.1 ; 43.66,20.1 43.69,20.13 v1(43.69,20.13) ; v1(50.04,20.13) 50.05,20.12 50.05,20.1 ; v1(56.26,20.13) 56.34,20.13 56.37,20.1
  Bottom Layer w1.016: CN1.18 CN1.17 49.67,10.05 57.15,17.53 57.15,19.56 56.61,20.1 18.07,20.1 16.64,18.67 v1(16.64,18.41) v1(16.64,17.91)
+5VP: length 23.8
  Top Layer w0.254: U17.7 24.38,7.25 24.89,6.73 C60.2 v1(26.1,7.46) 26.1,8.2 R37.2
  Top Layer w0.305: L1.1 15.43,14.73 v1(16,14.73)
  Top Layer w0.762: U18.2 11.42,14.79 L1.1
  Bottom Layer w0.305: v1(16,14.73) 20.83,14.73 26.1,9.46 v1(26.1,7.46)
+12V_EL: length 52.2
  Top Layer w0.203: R36.1 21.47,13.07 23.75,10.8 28.19,10.8 28.83,10.16 28.83,6.22 26.92,4.32 26.92,3.48 C55.1
  Top Layer w1.778: C55.1 26.22,1.91 48.9,1.91 51.67,4.68 CN1.20 CN1.19
AGND: length 17.6
  Top Layer w0.203: LED3.1 29.84,9.82 29.84,10.42 29.16,11.1 23.88,11.1 21.6,13.38 19.39,13.38 18.92,13.84 17.53,13.84 17.27,13.59 17.27,13.45 R35.1 ; 46.1,24.77 46,24.89 44.63,24.89 44.37,25.15 v1(44.2,25.15)
  vias: v1(0.76,29.59) v1(0.76,26.92) v1(0.76,24.89) v1(0.76,22.35) v1(0.76,19.81) v1(0.76,17.27) v1(0.76,14.73) v1(0.76,12.19) v1(0.76,9.65) v1(0.76,7.11) v1(0.76,4.57) v1(2.41,27.81) v1(2.41,22.73) v1(2.41,20.19) v1(2.41,17.65) v1(2.41,12.57) v1(2.41,10.03) v1(2.41,7.49) v1(2.77,26.7) v1(2.77,14) v1(2.77,8.92) v1(2.77,6.38) v1(3.66,23.39) v1(4.44,24.26) v1(4.7,33.91) v1(4.95,27.81) v1(4.95,25.27) v1(4.95,15.11) v1(4.95,12.57) v1(4.95,10.03) v1(4.95,7.49) v1(4.95,4.95) v1(5.31,29.24) v1(5.31,26.7) v1(5.31,3.84) v1(5.31,1.3) v1(5.46,23.37) v1(5.59,17.78) v1(5.61,17.13) v1(7.49,32.89) v1(7.49,30.35) v1(7.49,27.81) v1(7.49,17.53) v1(7.49,15.11) v1(7.49,2.41) v1(7.75,23.24) v1(7.75,22.35) v1(7.85,31.78) v1(7.85,29.24) v1(7.85,26.7) v1(7.85,24.16) v1(7.8,17.02) v1(7.85,1.3) v1(10.03,32.89) v1(10.03,30.35) v1(10.03,27.81) v1(10.03,25.27) v1(10.03,20.19) v1(10.03,17.65) v1(10.03,2.41) v1(10.39,31.78) v1(10.39,29.24) v1(10.39,26.7) v1(10.39,24.16) v1(10.39,1.3) v1(11.56,24.26) v1(11.56,6.48) v1(11.56,4.89) v1(11.7,20.38) v1(12.57,32.89) v1(12.57,25.27) v1(12.57,20.19) v1(12.57,17.65) v1(12.57,2.41) v1(12.83,22.99) v1(12.83,21.59) v1(12.93,24.16) v1(12.93,3.84) v1(12.93,1.3) v1(12.95,13.46) v1(13.34,8.25) v1(13.59,33.53) v1(15.02,4.03) v1(15.11,30.35) v1(15.11,27.81) v1(15.11,22.73) v1(15.11,12.57) v1(15.11,10.03) v1(15.47,29.24) v1(15.47,26.7) v1(15.47,21.62) v1(15.47,11.46) v1(16.13,33.53) v1(16.51,16.76) v1(16.64,5.62) v1(17.4,21.08) v1(17.65,25.27) v1(17.65,10.03) v1(17.65,4.95) v1(18.01,29.24) v1(18.01,26.7) v1(18.01,24.16) v1(18.01,16.54) v1(18.54,23.11) v1(18.54,19.05) v1(18.67,33.53) v1(18.93,4.34) v1(19.18,12.32) v1(19.17,5.72) v1(19.3,7.87) v1(19.56,21.08) v1(19.84,5.72) v1(19.94,24.38) v1(19.89,9.37) v1(20.11,31.16) v1(20.07,19.05) v1(20.19,12.32) v1(20.31,10.03) v1(20.55,14) v1(20.55,11.46) v1(20.54,9.37) v1(20.5,5.72) v1(20.7,26.54) v1(20.95,10.03) v1(20.94,4.45) v1(21.21,33.53) v1(21.21,12.32) v1(21.19,9.37) v1(21.17,5.72) v1(21.47,6.32) v1(21.58,10.03) v1(21.62,8.46) v1(21.62,7.82) v1(21.62,7.19) v1(21.84,29.21) v1(21.84,9.37) v1(21.84,5.72) v1(22.1,11.43) v1(22.1,6.32) v1(22.22,24.64) v1(22.18,8.45) v1(22.18,7.82) v1(22.18,7.18) v1(22.26,10.03) v1(22.49,9.37) v1(22.5,5.72) v1(22.64,31.16) v1(22.73,23.49) v1(22.73,17.65) v1(22.86,21.08) v1(22.9,10.03) v1(22.96,4.45) v1(23.09,19.08) v1(23.09,16.54) v1(23.14,9.37) v1(23.17,5.72) v1(23.53,10.03) v1(23.75,33.53) v1(23.79,9.37) v1(23.84,5.72) v1(24.35,29.21) v1(24.38,7.87) v1(24.51,5.72) v1(24.88,4.45) v1(25.2,31.16) v1(25.22,23.37) v1(25.27,17.65) v1(25.27,15.11) v1(25.27,7.49) v1(25.63,24.16) v1(25.63,19.08) v1(25.63,14) v1(25.72,21.2) v1(25.78,5.72) v1(26.29,33.53) v1(26.92,29.21) v1(26.92,12.95) v1(27.83,31.16) v1(28.19,30.1) v1(28.41,18.8) v1(28.45,4.83) v1(28.57,24.13) v1(28.83,33.53) v1(28.94,23.37) v1(28.96,21.08) v1(29.21,27.3) v1(29.84,10.8) v1(30.35,17.65) v1(30.35,15.11) v1(30.35,4.95) v1(30.71,29.24) v1(30.71,16.54) v1(30.99,9.65) v1(31.37,33.53) v1(31.59,23.37) v1(31.71,24) v1(31.83,21.08) v1(32.32,18.8) v1(32.26,14.73) v1(32.89,30.35) v1(32.89,4.95) v1(33.25,29.24) v1(33.25,3.84) v1(33.4,27.18) v1(33.91,33.53) v1(33.91,25.15) v1(34.42,18.8) v1(34.87,21.08) v1(35.35,23.39) v1(35.43,32.89) v1(35.43,17.65) v1(35.43,15.11) v1(35.43,4.95) v1(35.79,16.54) v1(35.79,3.84) v1(36.07,27.05) v1(36.19,10.92) v1(36.19,10.03) v1(36.45,33.66) v1(37.21,25.15) v1(37.78,23.39) v1(37.97,32.89) v1(37.97,17.65) v1(37.97,15.11) v1(37.97,12.57) v1(37.97,4.95) v1(38.09,21.08) v1(38.18,10.03) v1(38.33,31.78) v1(38.33,29.24) v1(38.33,26.7) v1(38.33,19.08) v1(38.33,3.84) v1(38.99,33.66) v1(40.51,32.89) v1(40.51,25.27) v1(40.51,10.03) v1(40.51,4.95) v1(40.87,31.78) v1(40.87,29.24) v1(40.87,24.16) v1(40.87,11.46) v1(40.87,3.84) v1(40.99,21.08) v1(41.15,18.8) v1(41.28,16.76) v1(41.28,13.86) v1(41.53,33.66) v1(42.67,9.98) v1(43.05,32.89) v1(43.05,17.65) v1(43.05,15.11) v1(43.05,12.57) v1(43.05,4.95) v1(43.41,31.78) v1(43.41,29.24) v1(43.41,16.54) v1(43.41,14) v1(43.41,3.84) v1(44.07,33.66) v1(44.16,21.08) v1(44.45,18.92) v1(44.69,9.98) v1(45.34,26.16) v1(45.59,32.89) v1(45.59,4.95) v1(45.85,13.72) v1(45.95,31.78) v1(45.95,29.24) v1(45.95,3.84) v1(46.23,27.56) v1(46.48,24.64) v1(46.48,12.45) v1(46.61,33.66) v1(46.74,18.54) v1(46.74,10.41) v1(47.19,21.08) v1(47.5,26.54) v1(48.01,23.49) v1(48.13,32.89) v1(48.13,17.65) v1(48.13,15.11) v1(48.13,12.45) v1(48.13,4.95) v1(48.49,31.78) v1(48.49,16.54) v1(48.51,10.41) v1(48.49,3.84) v1(48.9,13.97) v1(49.02,29.46) v1(49.15,33.66) v1(50.02,24.64) v1(50.13,16.78) v1(50.16,5.72) v1(50.37,21.08) v1(50.67,32.89) v1(50.67,30.35) v1(50.67,27.81) v1(51.03,31.78) v1(51.03,29.24) v1(51.03,26.7) v1(51.03,1.3) v1(51.69,33.66) v1(51.94,14.99) v1(52.83,18.8) v1(53.21,32.89) v1(53.21,30.35) v1(53.21,27.81) v1(53.21,25.27) v1(53.21,4.95) v1(53.21,2.41) v1(53.28,21.08) v1(53.47,11.94) v1(53.57,31.78) v1(53.57,29.24) v1(53.57,26.7) v1(53.57,24.16) v1(53.57,6.38) v1(53.57,3.84) v1(53.57,1.3) v1(53.72,15.88) v1(54.23,33.66) v1(54.36,18.67) v1(55.5,17.77) v1(55.75,32.89) v1(55.75,30.35) v1(55.75,27.81) v1(55.75,25.27) v1(55.75,12.57) v1(55.75,4.95) v1(55.75,2.41) v1(56.11,31.78) v1(56.11,29.24) v1(56.11,26.7) v1(56.11,6.38) v1(56.11,3.84) v1(56.11,1.3) v1(56.26,14.73) v1(56.62,21.08) v1(56.7,23.31) v1(56.77,33.66) v1(57.53,12.32) v1(58.29,27.81) v1(58.29,25.27) v1(58.29,22.73) v1(58.29,20.19) v1(58.29,17.65) v1(58.65,26.7) v1(58.65,24.16) v1(58.65,21.62) v1(58.65,19.08) v1(58.65,6.38) v1(58.8,14.73) v1(60.83,27.81) v1(60.83,25.27) v1(60.83,22.73) v1(60.83,20.19) v1(60.83,17.65) v1(60.83,15.11) v1(60.83,12.57) v1(60.83,10.03) v1(60.83,7.49) v1(60.83,4.95)
CLK: length 8.4
  Top Layer w0.203: PMODA.7 43.27,24.51 45.59,24.51 45.92,24.19 U1.2
CP1: length 12.1
  Top Layer w0.203: R3.2 51.18,14.99 49.28,13.08 46.1,13.08 43.69,10.67 43.69,8.89 CN1.11
CP2: length 8.9
  Top Layer w0.203: R1.2 45.97,14.73 41.67,10.43 CN1.9
HSYNC: length 11.4
  Top Layer w0.203: PMODA.5 45.04,25.27 50.29,25.27 51.56,24 51.56,23.38 U2.3
LD0: length 11.2
  Top Layer w0.203: R7.2 32.77,15.11 36.7,11.18 36.7,7.75 37.58,6.87 CN1.6
LD1: length 8.6
  Top Layer w0.203: R6.2 34.16,15.24 37.67,11.73 CN1.5
LD2: length 9.7
  Top Layer w0.203: R5.2 38.66,15.82 38.66,7.89 CN1.8
LD3: length 7.4
  Top Layer w0.203: R4.2 40.26,12.7 39.67,12.11 CN1.7
LD_0: length 12.4
  Top Layer w0.203: U4.3 33.13,24.28 32.64,24.77 27.94,24.77 26.67,26.03 24.51,26.03 23.92,26.63 PMODB.3
LD_1: length 14.8
  Top Layer w0.203: U4.2 33.63,24.54 32.89,25.27 28.32,25.27 27.05,26.54 25.4,26.54 25.15,26.8 25.15,29.24 23.92,30.47
LD_2: length 15.1
  Top Layer w0.203: PMODB.1 28.61,25.78 37.47,25.78 39.27,23.97 U3.3
LD_3: length 17.7
  Top Layer w0.203: 26.46,30.47 28.19,28.74 28.19,27.05 28.96,26.29 37.59,26.29 39.75,24.13 39.75,23.39 U3.2
S: length 11.9
  Top Layer w0.203: R2.2 52.58,14.48 49.91,11.81 46.74,11.81 45.67,10.75 CN1.13
UD0: length 18.1
  Top Layer w0.203: CN1.2 33.38,6.87 31.62,8.64 31.62,10.29 30.48,11.43 24.92,11.43 R11.2
UD1: length 15.7
  Top Layer w0.203: CN1.1 33.78,8.98 33.78,9.91 31.37,12.32 25.43,12.32 R10.2
UD2: length 15.4
  Top Layer w0.203: CN1.4 34.67,7.88 34.67,10.41 31.88,13.21 27.69,13.21 26.42,14.48 R9.2
UD3: length 12.6
  Top Layer w0.203: CN1.3 35.67,10.81 32.38,14.1 28.7,14.1 27.81,14.99 R8.2
UD_0: length 5.4
  Top Layer w0.203: U6.3 20.83,24.63 18.84,26.63 PMODB.7
UD_1: length 8.1
  Top Layer w0.203: U6.2 21.33,24.9 20.07,26.16 20.07,29.24 18.84,30.47
UD_2: length 8.6
  Top Layer w0.203: PMODB.5 21.38,26.75 23.11,25.02 26.03,25.02 26.98,24.08 U5.3
UD_3: length 11.3
  Top Layer w0.203: 27.48,23.37 27.48,24.37 26.32,25.53 23.5,25.53 22.61,26.42 22.61,29.24 21.38,30.47
VSYNC: length 9.6
  Top Layer w0.203: U2.2 52.07,23.38 52.07,24.26 50.55,25.78 47.08,25.78 PMODA.3
$1N1810: length 3.2
  Top Layer w0.203: U2.7 52.07,18.05 52.58,17.53
$1N1813: length 3.2
  Top Layer w0.203: 51.18,17.53 51.57,17.92 U2.6
$1N2397: length 3.1
  Top Layer w0.203: R1.1 45.92,17.57 U1.7
$1N3960: length 3.2
  Top Layer w0.203: U3.7 39.77,18.02 40.26,17.53
$1N3962: length 3.2
  Top Layer w0.203: U3.6 39.27,17.94 38.86,17.53
$1N10501: length 3.3
  Top Layer w0.203: U4.7 33.63,18.07 34.16,17.53
$1N10502: length 3.2
  Top Layer w0.203: U4.6 33.13,17.89 32.77,17.53
$1N10708: length 3.2
  Top Layer w0.203: 27.48,20.57 27.48,17.87 27.81,17.53
$1N10709: length 3.3
  Top Layer w0.203: U5.6 26.98,18.1 26.42,17.53
$1N10915: length 3.1
  Top Layer w0.203: U6.7 21.33,17.79 21.59,17.53
$1N10916: length 3.2
  Top Layer w0.203: 20.32,17.53 20.83,18.05 U6.6
$2N5370: length 4.1
  Top Layer w0.203: R17.1 9.79,21.34 9.14,21.34 7.77,19.96 USB1.B5
$2N5376: length 4.3
  Top Layer w0.203: R18.1 9.4,22.99 7.37,20.96 USB1.A5
$2N5502: length 6.5
  Top Layer w0.762: USB1.A9 5.04,18.96 4.44,19.56 4.44,21.34 5.07,21.96 USB1.B9
$2N10772: length 6
  Top Layer w0.203: U17.2 19.82,8.25 19.3,8.76 19.3,10.55 R36.2 R35.2
$2N10889: length 5.6
  Top Layer w0.203: U17.9 23.87,8.25 25.4,9.78 C59.1 27.55,8.33 R37.1
$2N11071: length 2.1
  Top Layer w0.203: D5.1 29.62,3.93 R38.1
$2N11072: length 1.2
  Top Layer w0.203: LED3.2 29.97,8.09 D5.2

## Copper pours and planes (outline as drawn; the poured copper is in the pictures)
+5V on Top Layer: 15.65,18.91 17.27,18.91 17.27,17.4 15.65,17.4
+5VP on Top Layer: 5.84,16 12.95,16 12.95,4.32 5.84,4.32
+12V_EL on Top Layer: 15.24,3.56 26.68,3.56 26.68,1.02 15.24,1.02
+12V_EL on Top Layer: 50.93,11.3 58.29,11.3 58.29,6.47 50.93,6.47
AGND on Top Layer: 5.45,18.23 7.1,18.23 7.1,17.39 5.45,17.39
AGND on Top Layer: -0.13,34.54 61.98,34.54 61.98,-0.25 -0.13,-0.25
AGND on Top Layer: 18.68,5.72 26.49,5.72 26.49,3.74 18.68,3.74
AGND on Top Layer: 21.19,9.07 22.65,9.07 22.65,6.32 21.19,6.32
AGND on Top Layer: 4.95,17.76 7.8,17.76 7.8,17.02 4.95,17.02
AGND on Top Layer: 5.46,24 7.87,24 7.87,22.86 5.46,22.86
AGND on Bottom Layer: -0.13,34.67 61.98,34.67 61.98,-0.13 -0.13,-0.13
$2N5502 on Top Layer: 6.57,19.43 9.78,19.43 9.78,18.03 6.57,18.03
$2N5502 on Top Layer: 3.32,22.61 6.1,22.61 6.1,18.5 3.32,18.5
$2N10283 on Top Layer: 12.32,8.89 20.96,8.89 20.96,4.57 12.32,4.57

## Text on the board
Bottom Silkscreen Layer: 1 | 0 | UD | 3 | 2 | LD | C | H | V
Top Silkscreen Layer: EL Display_Con Rev.A | 20240511 | MN / DJ | 5V 3A MAX | +12VOK
